# Altium schematic sheet gyro.SchDoc
size A
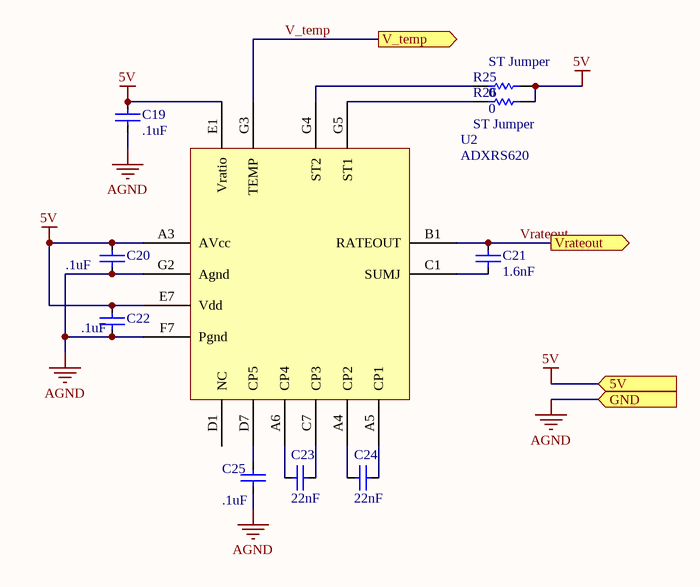
[diagram p0: gyro.SchDoc]

## Parts
C19  value .1uF  [0603 (1608)]  (hidden comment: Capacitor)
C20  value .1uF  [0603 (1608)]  (hidden comment: Capacitor)
C21  value 1.6nF  [0603 (1608)]  (hidden comment: Capacitor)
C22  value .1uF  [0603 (1608)]  (hidden comment: Capacitor)
C23  value 22nF  [0603 (1608)]  (hidden comment: Capacitor)
C24  value 22nF  [0603 (1608)]  (hidden comment: Capacitor)
C25  value .1uF  [0603 (1608)]  (hidden comment: Capacitor)
R25  ST Jumper  value 0  [0603 (1608)]
R26  ST Jumper  value 0  [0603 (1608)]
U2  ADXRS620  [BGA_AXDR]

## Ports
5V (in), GND (in), V_temp (out), Vrateout (out)

## Nets
5V: C19.1 C20.1 C22.1 R25.2 R26.2 U2.A3(AVcc) U2.E1(Vratio) U2.E7(Vdd) ; port 5V
AGND: C19.2 C20.2 C22.2 C25.2 U2.F7(Pgnd) U2.G2(Agnd) ; port GND
V_temp: U2.G3(TEMP) ; port V_temp
Vrateout: C21.2 U2.B1(RATEOUT) ; port Vrateout
NetC21_1: C21.1 U2.C1(SUMJ)
NetC23_1: C23.1 U2.A6(CP4)
NetC23_2: C23.2 U2.C7(CP3)
NetC24_1: C24.1 U2.A4(CP2)
NetC24_2: C24.2 U2.A5(CP1)
NetC25_1: C25.1 U2.D7(CP5)
NetR25_1: R25.1 U2.G4(ST2)
NetR26_1: R26.1 U2.G5(ST1)

Not connected (* = marked no-connect by the designer): U2 D1(NC)

## Library data of the parts
C19 C20 C22 C25 = Capacitor: Manufacturer: Murata; Part No.: 490-1524-1-ND; Vendor: Digikey; Price Est.: $0.019
C21 = Capacitor: Manufacturer: Murata; Part No.: 490-1456-1-ND; Vendor: Digikey; Price Est.: $0.084
C23 C24 = Capacitor: Manufacturer: TDK; Part No.: 445-5104-1-ND; Vendor: Digikey; Price Est.: $0.03
R25 R26 = Res1: Resistor